# Altium schematic sheet Main.SchDoc: Main
size B; SheetNumber: 1; SheetTotal: 10
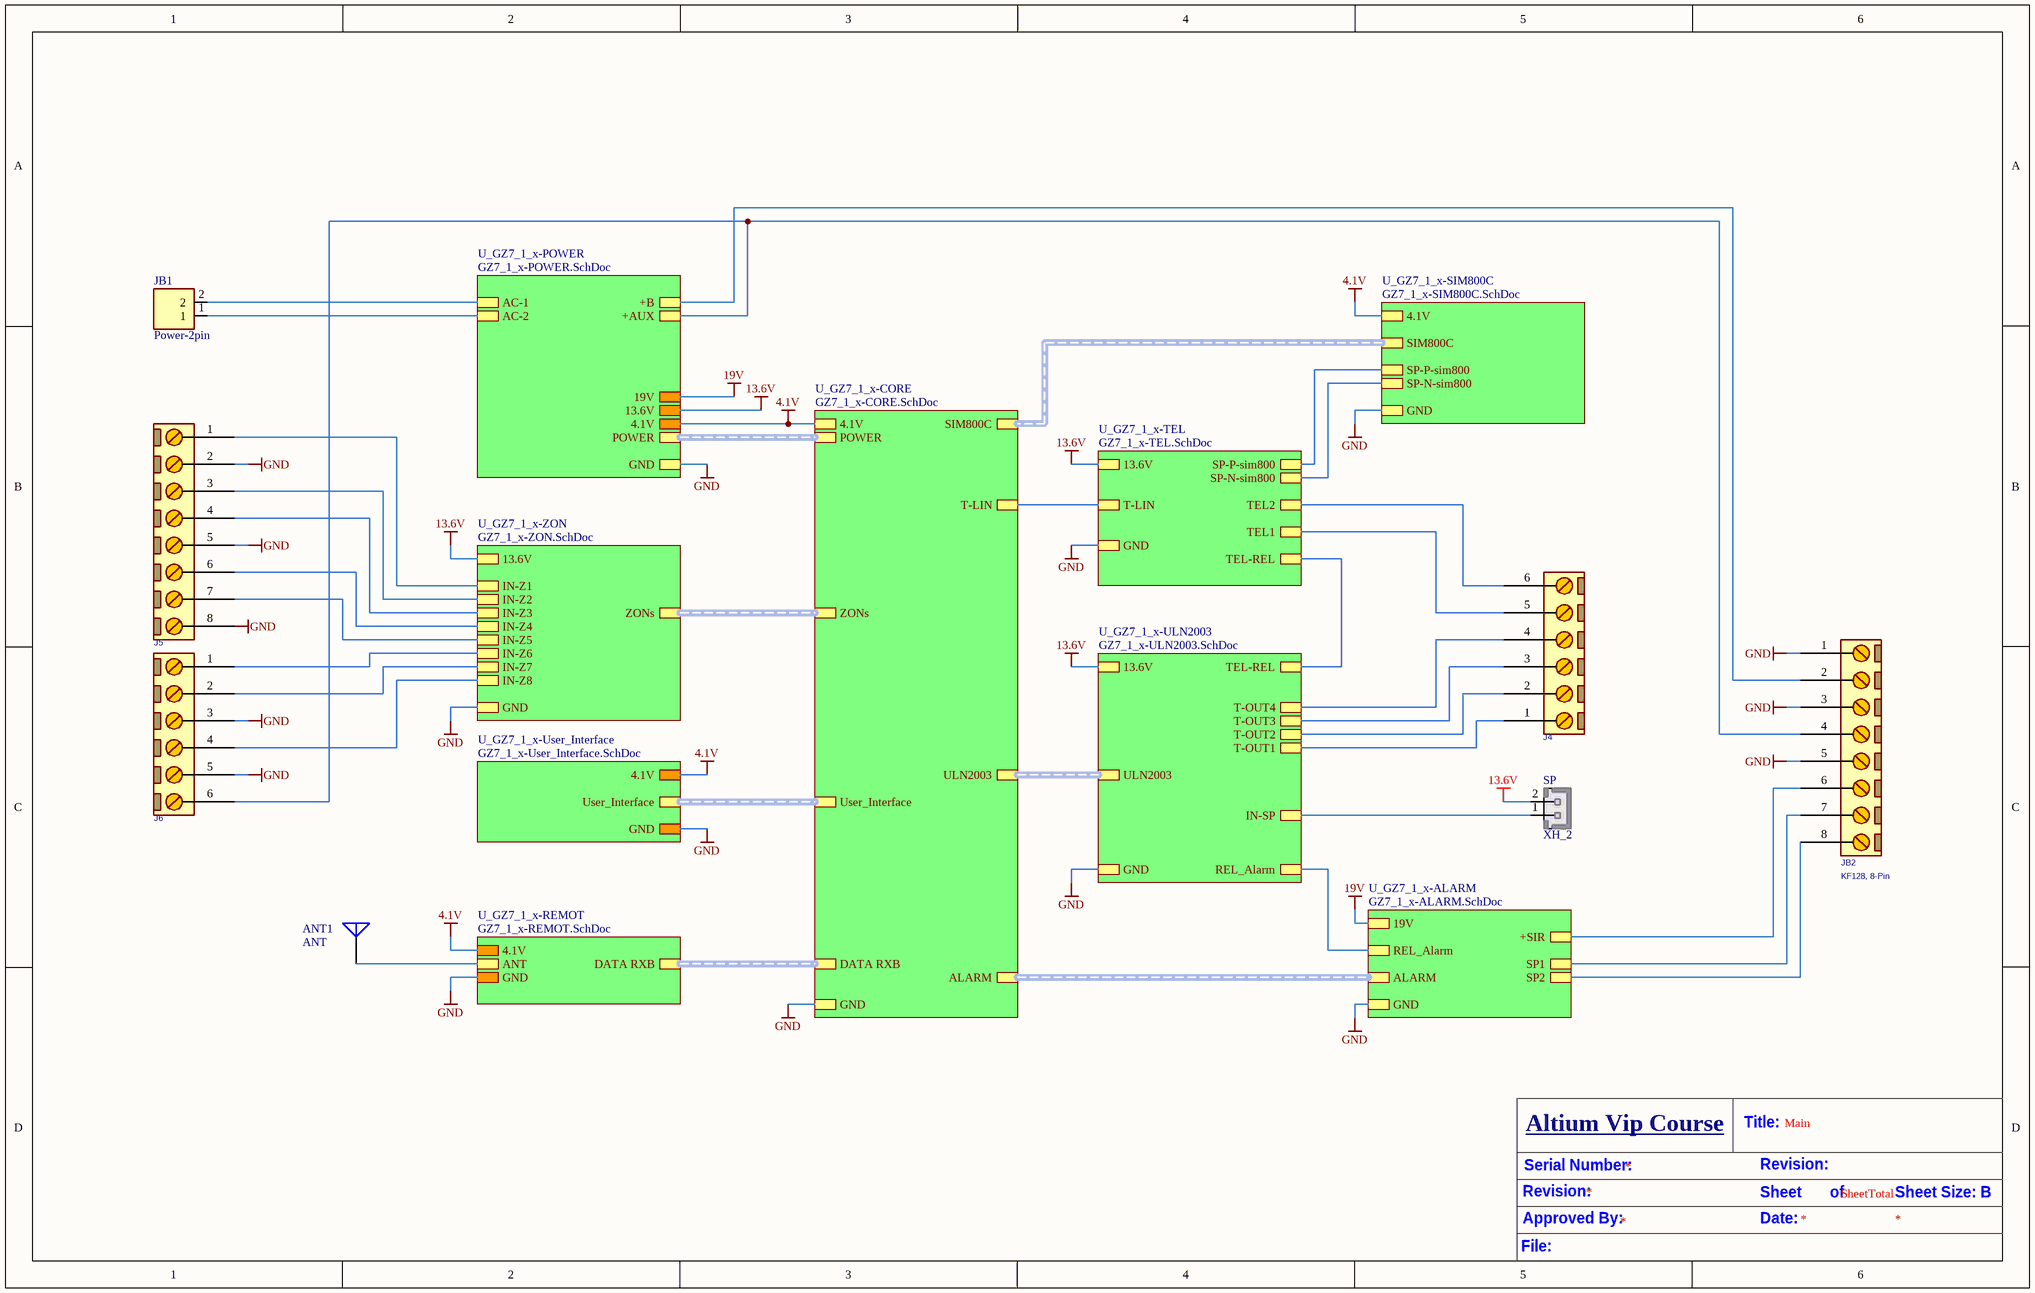
[diagram p0: Main.SchDoc]

## Parts
ANT1  ANT  [PAD-ANT]
J4  CONN_TB6  [T_4_OUT_TEL]  (value not drawn)
J5  CONN_TB8  [CON-Z_1_4]  (value not drawn)
J6  CONN_TB6  [CON-Z_5_8]  (value not drawn)
JB1  Power-2pin  [PWL_2]
JB2  KF128, 8-Pin  [CON8-AUX]
SP  XH_2  [XH_2]

## Sub-sheets
U_GZ7_1_x-ALARM = GZ7_1_x-ALARM.SchDoc: 19V, REL_Alarm, GND, +SIR, SP2, SP1, ALARM (harness a_ALARM)
U_GZ7_1_x-CORE = GZ7_1_x-CORE.SchDoc: 4.1V, GND, ZONs (harness ZON), SIM800C (harness SIM800C), ULN2003 (harness ULN2003), DATA RXB (harness RXB), POWER (harness a_POWER), User_Interface (harness User), ALARM (harness a_ALARM), T-LIN
U_GZ7_1_x-POWER = GZ7_1_x-POWER.SchDoc: 13.6V, 19V, 4.1V, GND, AC-2, AC-1, +B, +AUX, POWER (harness a_POWER)
U_GZ7_1_x-REMOT = GZ7_1_x-REMOT.SchDoc: 4.1V, GND, ANT, DATA RXB (harness RXB)
U_GZ7_1_x-SIM800C = GZ7_1_x-SIM800C.SchDoc: 4.1V, GND, SIM800C (harness SIM800C), SP-P-sim800, SP-N-sim800
U_GZ7_1_x-TEL = GZ7_1_x-TEL.SchDoc: GND, TEL-REL, TEL1, TEL2, 13.6V, T-LIN, SP-P-sim800, SP-N-sim800
U_GZ7_1_x-ULN2003 = GZ7_1_x-ULN2003.SchDoc: REL_Alarm, 13.6V, GND, T-OUT1, T-OUT2, T-OUT3, IN-SP, ULN2003 (harness ULN2003), T-OUT4, TEL-REL
U_GZ7_1_x-User_Interface = GZ7_1_x-User_Interface.SchDoc: User_Interface (harness User), 4.1V, GND
U_GZ7_1_x-ZON = GZ7_1_x-ZON.SchDoc: 13.6V, GND, IN-Z1, IN-Z2, IN-Z3, IN-Z4, ZONs (harness ZON), IN-Z5, IN-Z6, IN-Z7, IN-Z8

## Nets
4.1V: sheet U_GZ7_1_x-POWER/4.1V, sheet U_GZ7_1_x-User_Interface/4.1V, sheet U_GZ7_1_x-REMOT/4.1V, sheet U_GZ7_1_x-CORE/4.1V, sheet U_GZ7_1_x-SIM800C/4.1V
13.6V: SP.2 ; sheet U_GZ7_1_x-POWER/13.6V, sheet U_GZ7_1_x-ZON/13.6V, sheet U_GZ7_1_x-TEL/13.6V, sheet U_GZ7_1_x-ULN2003/13.6V
19V: sheet U_GZ7_1_x-POWER/19V, sheet U_GZ7_1_x-ALARM/19V
GND: J5.2 J5.5 J5.8 J6.3 J6.5 JB2.1 JB2.3 JB2.5 ; sheet U_GZ7_1_x-POWER/GND, sheet U_GZ7_1_x-ZON/GND, sheet U_GZ7_1_x-User_Interface/GND, sheet U_GZ7_1_x-REMOT/GND, sheet U_GZ7_1_x-CORE/GND, sheet U_GZ7_1_x-TEL/GND, sheet U_GZ7_1_x-ULN2003/GND, sheet U_GZ7_1_x-SIM800C/GND, sheet U_GZ7_1_x-ALARM/GND
NetANT1_1: ANT1.1(A) ; sheet U_GZ7_1_x-REMOT/ANT
NetJ4_1: J4.1 ; sheet U_GZ7_1_x-ULN2003/T-OUT1
NetJ4_2: J4.2 ; sheet U_GZ7_1_x-ULN2003/T-OUT2
NetJ4_3: J4.3 ; sheet U_GZ7_1_x-ULN2003/T-OUT3
NetJ4_4: J4.4 ; sheet U_GZ7_1_x-ULN2003/T-OUT4
NetJ4_5: J4.5 ; sheet U_GZ7_1_x-TEL/TEL1
NetJ4_6: J4.6 ; sheet U_GZ7_1_x-TEL/TEL2
NetJ5_1: J5.1 ; sheet U_GZ7_1_x-ZON/IN-Z1
NetJ5_3: J5.3 ; sheet U_GZ7_1_x-ZON/IN-Z2
NetJ5_4: J5.4 ; sheet U_GZ7_1_x-ZON/IN-Z3
NetJ5_6: J5.6 ; sheet U_GZ7_1_x-ZON/IN-Z4
NetJ5_7: J5.7 ; sheet U_GZ7_1_x-ZON/IN-Z5
NetJ6_1: J6.1 ; sheet U_GZ7_1_x-ZON/IN-Z6
NetJ6_2: J6.2 ; sheet U_GZ7_1_x-ZON/IN-Z7
NetJ6_4: J6.4 ; sheet U_GZ7_1_x-ZON/IN-Z8
NetJ6_6: J6.6 JB2.4 ; sheet U_GZ7_1_x-POWER/+AUX
NetJB1_1: JB1.1 ; sheet U_GZ7_1_x-POWER/AC-2
NetJB1_2: JB1.2 ; sheet U_GZ7_1_x-POWER/AC-1
NetJB2_2: JB2.2 ; sheet U_GZ7_1_x-POWER/+B
NetJB2_6: JB2.6 ; sheet U_GZ7_1_x-ALARM/+SIR
NetJB2_7: JB2.7 ; sheet U_GZ7_1_x-ALARM/SP1
NetJB2_8: JB2.8 ; sheet U_GZ7_1_x-ALARM/SP2
NetSP_1: SP.1 ; sheet U_GZ7_1_x-ULN2003/IN-SP
(unnamed): sheet U_GZ7_1_x-CORE/T-LIN, sheet U_GZ7_1_x-TEL/T-LIN
(unnamed): sheet U_GZ7_1_x-TEL/TEL-REL, sheet U_GZ7_1_x-ULN2003/TEL-REL
(unnamed): sheet U_GZ7_1_x-TEL/SP-P-sim800, sheet U_GZ7_1_x-SIM800C/SP-P-sim800
(unnamed): sheet U_GZ7_1_x-TEL/SP-N-sim800, sheet U_GZ7_1_x-SIM800C/SP-N-sim800
(unnamed): sheet U_GZ7_1_x-ULN2003/REL_Alarm, sheet U_GZ7_1_x-ALARM/REL_Alarm

## Buses and harness runs
harness sheet U_GZ7_1_x-ALARM/ALARM = sheet U_GZ7_1_x-CORE/ALARM
harness sheet U_GZ7_1_x-CORE/DATA RXB = sheet U_GZ7_1_x-REMOT/DATA RXB
harness sheet U_GZ7_1_x-CORE/POWER = sheet U_GZ7_1_x-POWER/POWER
harness sheet U_GZ7_1_x-CORE/SIM800C = sheet U_GZ7_1_x-SIM800C/SIM800C
harness sheet U_GZ7_1_x-CORE/ULN2003 = sheet U_GZ7_1_x-ULN2003/ULN2003
harness sheet U_GZ7_1_x-CORE/User_Interface = sheet U_GZ7_1_x-User_Interface/User_Interface
harness sheet U_GZ7_1_x-CORE/ZONs = sheet U_GZ7_1_x-ZON/ZONs

## Notes on the sheet
- Serial Number:
- Altium Vip Course
- Title:
- Revision:
- Approved By:
- Date:
- Sheet       of
- SheetTotal
- Sheet Size: B
- File:

## Library data of the parts
ANT1 = Antenna: Multilayer Chip Antenna; Published: 24-Mar-1999; LatestRevisionDate: 17-Jul-2002; LatestRevisionNote: Re-released for DXP Platform.; PackageReference: PIN1; Publisher: Altium Limited
J4 J6 = CONN_TB6: CONN, TERMINAL BLOCK, 5.08mm pitch; VALUE: CONN_TB6
J5 JB2 = CONN_TB8: CONN, TERMINAL BLOCK, 5.08mm pitch; VALUE: CONN_TB8
JB1 = CONN_PWL_2: Power Terminal 2pin,Header, 2-Pin; VALUE: CONN_PWL_2
SP = XH_2: PW10-x-M, JST-BxB-XH-A pitch: 2.5mm, 3A/250v; MANF: JST; MANF_P#: B2B-XH-A; PARAM2: 250v; PARAM: 3.0A; VALUE: XH_2